# Altium schematic sheet Interface.SchDoc: FlightControlBoard-Interface
size A4; SheetNumber: 5; SheetTotal: 5
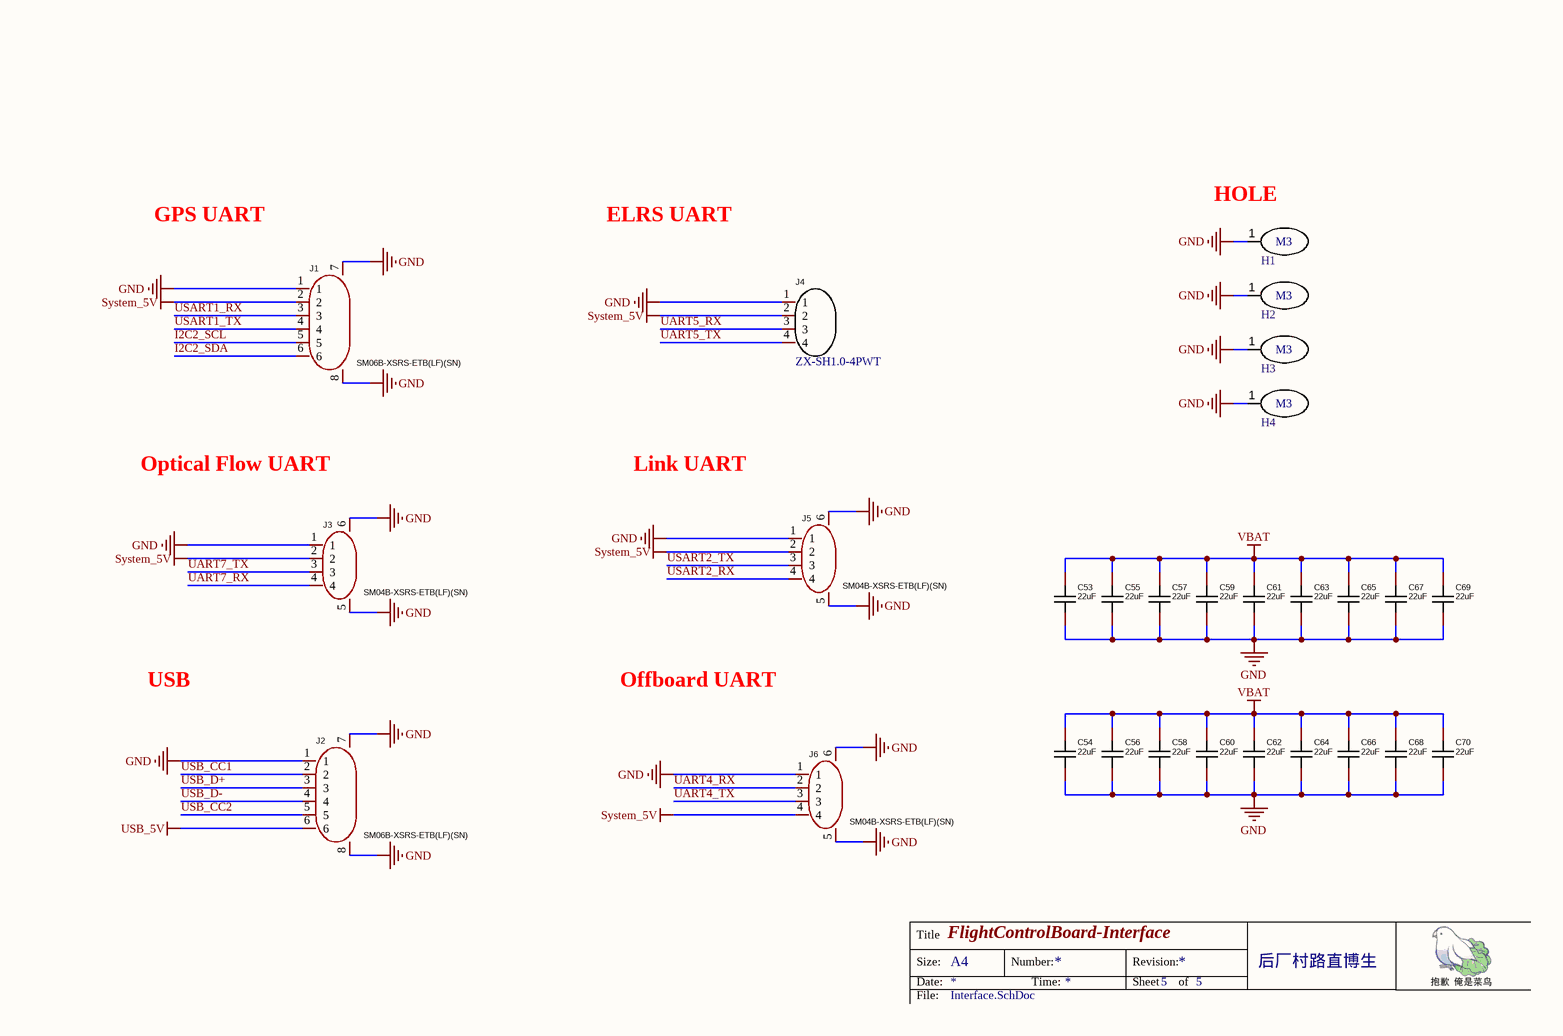
[diagram p0: Interface.SchDoc]

## Parts
C53  22uF  [C0805]
C54  22uF  [C0805]
C55  22uF  [C0805]
C56  22uF  [C0805]
C57  22uF  [C0805]
C58  22uF  [C0805]
C59  22uF  [C0805]
C60  22uF  [C0805]
C61  22uF  [C0805]
C62  22uF  [C0805]
C63  22uF  [C0805]
C64  22uF  [C0805]
C65  22uF  [C0805]
C66  22uF  [C0805]
C67  22uF  [C0805]
C68  22uF  [C0805]
C69  22uF  [C0805]
C70  22uF  [C0805]
H1  M3_HOLE  [M3_HOLE]  (value not drawn)
H2  M3_HOLE  [M3_HOLE]  (value not drawn)
H3  M3_HOLE  [M3_HOLE]  (value not drawn)
H4  M3_HOLE  [M3_HOLE]  (value not drawn)
J1  SM06B-XSRS-ETB(LF)(SN)  [CONN-SMD_6P-P0.6]
J2  SM06B-XSRS-ETB(LF)(SN)  [CONN-SMD_6P-P0.6]
J3  SM04B-XSRS-ETB(LF)(SN)  [CONN-SMD_4P-P0.6]
J4  ZX-SH1.0-4PWT  [ELRSPad]
J5  SM04B-XSRS-ETB(LF)(SN)  [CONN-SMD_4P-P0.6]
J6  SM04B-XSRS-ETB(LF)(SN)  [CONN-SMD_4P-P0.6]

## Nets
GND: C53.2 C54.2 C55.2 C56.2 C57.2 C58.2 C59.2 C60.2 C61.2 C62.2 C63.2 C64.2 C65.2 C66.2 C67.2 C68.2 C69.2 C70.2 H1.1 H2.1 H3.1 H4.1 J1.1 J1.7 J1.8 J2.1 J2.7 J2.8 J3.1 J3.5 J3.6 J4.1 J5.1 J5.5 J5.6 J6.1 J6.5 J6.6
System_5V: J1.2 J3.2 J4.2 J5.2 J6.4
USB_5V: J2.6
VBAT: C53.1 C54.1 C55.1 C56.1 C57.1 C58.1 C59.1 C60.1 C61.1 C62.1 C63.1 C64.1 C65.1 C66.1 C67.1 C68.1 C69.1 C70.1
I2C2_SCL: J1.5
I2C2_SDA: J1.6
UART4_RX: J6.2
UART4_TX: J6.3
UART5_RX: J4.3
UART5_TX: J4.4
UART7_RX: J3.4
UART7_TX: J3.3
USART1_RX: J1.3
USART1_TX: J1.4
USART2_RX: J5.4
USART2_TX: J5.3
USB_CC1: J2.2
USB_CC2: J2.5
USB_D+: J2.3
USB_D-: J2.4

## Notes on the sheet
- GPS UART
- ELRS UART
- (near H1) HOLE
- Optical Flow UART
- Link UART
- USB
- Offboard UART
- Title
- Size:
- Date:
- A4
- Number:
- Time:
- Revision:
- Sheet
- of
- 后厂村路直博生
- File:
- (in symbol M3_HOLE) M3

## Library data of the parts
C53-C70 = CC0603KRX7R9BB104: Add into BOM: yes; Convert to PCB: yes; Value: 22uF
J1 J2 = SM06B-XSRS-ETB(LF)(SN): Manufacturer: JST; Add into BOM: yes; Pitch: 0.6mm; Current Rating (Max): 200mA; Symbol: SM06B-XSRS-ETB(LF)(SN); Device: SM06B-XSRS-ETB(LF)(SN); LCSC Part Name: SM06B-XSRS-ETB(LF)(SN); Supplier Part: C5306600; Manufacturer Part: SM06B-XSRS-ETB(LF)(SN); Supplier Footprint: SMD,P=0.6mm,卧贴; JLCPCB Part Class: Extended Part; Datasheet: https://atta.szlcsc.com/upload/public/pdf/source/20211104/F92F039D0CBA277DB4B3F7158FB08335.pdf; Supplier: LCSC; Convert to PCB: yes; Mounting Style: 卧贴; Number of Rows: 1; Contact Material: 铜合金; Contact Plating: 锡; Operating Temperature Range: -25℃~+85℃
J3 J5 J6 = SM04B-XSRS-ETB(LF)(SN): Manufacturer: JST; Add into BOM: yes; Symbol: SM04B-XSRS-ETB(LF)(SN); Device: SM04B-XSRS-ETB(LF)(SN); LCSC Part Name: SM04B-XSRS-ETB(LF)(SN); Supplier Part: C5223639; Manufacturer Part: SM04B-XSRS-ETB(LF)(SN); Supplier Footprint: SMD; JLCPCB Part Class: Extended Part; Datasheet: https://atta.szlcsc.com/upload/public/pdf/source/20231218/E491C8E1E509E6459DF900917B8E5F93.pdf; Supplier: LCSC; Convert to PCB: yes
J4 = ELRSPad